# EAGLE design Final_eagle (EAGLE 9.2.0)
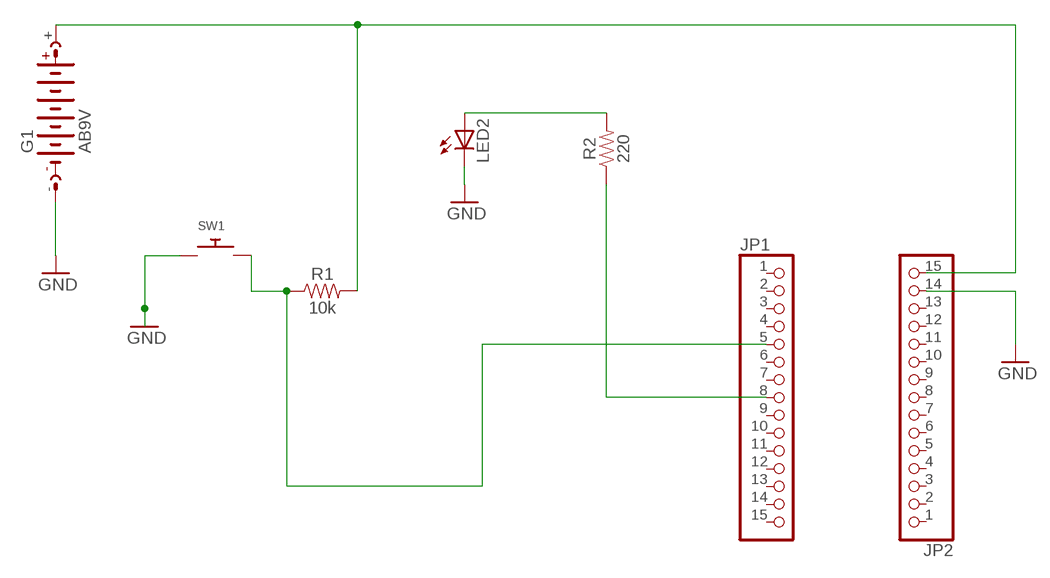
[diagram p0: schematic, sheet 1]

## Parts
G1  AB9V  [AB9V]
JP1  PINHD-1X15  [1X15]
JP2  PINHD-1X15  [1X15]
LED2  LED5MM  [LED5MM]
R1  10k  10KOHM-VERT-1/4W-5%  [AXIAL-0.1]
R2  220  100OHM-0603-1/4W-5%  [0603]
SW1  SWITCH_PUSHBUTTONEVQ-PE  [TACT_PANA-EVQ]

## Nets
GND: G1.- JP2.14 LED2.K(C) SW1.P$1
N$1: G1.+ JP2.15 R1.P$2
N$3: JP1.5 R1.P$1 SW1.P$2
N$4: JP1.8 R2.1
N$5: LED2.A R2.2
Unconnected: JP1.1 JP1.2 JP1.3 JP1.4 JP1.6 JP1.7 JP1.9 JP1.10 JP1.11 JP1.12 JP1.13 JP1.14 JP1.15 JP2.1 JP2.2 JP2.3 JP2.4 JP2.5 JP2.6 JP2.7 JP2.8 JP2.9 JP2.10 JP2.11 JP2.12 JP2.13

## Library data of the parts
G1 = battery:AB9V: 9-V BATTERY CLIP
JP1 JP2 = adafruit:PINHD-1X15: PIN HEADER
LED2 = adafruit:LED: LED OSRAM: - CHIPLED LG R971, LG N971, LY N971, LG Q971, LY Q971, LO R971, LY R971 LH N974, LH R974 LS Q976, LO Q976, LY Q976 LO Q996 - Hyper CHIPLED LW Q18S LB Q993, LB Q99A, LB R99A - SideLED LS A670, LO A670, LY A670, LG A670, LP A670 LB A673, LV A673, LT A673, LW A673 LH A674 LY A675 LS A676, LA A676, LO A676, LY A676, LW A676 LS A679, LY A679, LG A679 - Hyper Micro SIDELED® LS Y876, LA Y876, LO Y876, LY Y876 LT Y87S - SmartLED LW L88C, LW L88S LB L89C, LB L89S, LG L890 LS L89K, LO L89K, LY L89K LS L896, LA L896, LO L896, LY L896 - TOPLED LS T670, LO T670, LY T670, LG T670, LP T670 LSG T670, LSP T670, LSY T670, LOP T670, LYG T670 LG T671, LOG T671, LSG T671 LB T673, LV T673, LT T673, LW T673 LH T674 LS T676, LA T676, LO T676, LY T676, LB T676, LH T676, LSB T676, LW T676 LB T67C, LV T67C, LT T67C, LS T67K, LO T67K, LY T67K, LW E67C LS E67B, LA E67B, LO E67B, LY E67B, LB E67C, LV E67C, LT E67C LW T67C LS T679, LY T679, LG T679 LS T770, LO T770, LY T770, LG T770, LP T770 LB T773, LV T773, LT T773, LW T773 LH T774 LS E675, LA E675, LY E675, LS T675 LS T776, LA T776, LO T776, LY T776, LB T776 LHGB T686 LT T68C, LB T68C - Hyper Mini TOPLED® LB M676 - Mini TOPLED Santana® LG M470 LS M47K, LO M47K, LY M47K Source: http://www.osram.convergy.de/
R1 = SparkFun-Resistors:10KOHM: 10kΩ resistor A resistor is a passive two-terminal electrical component that implements electrical resistance as a circuit element. Resistors act to reduce current flow, and, at the same time, act to lower voltage levels within circuits. - Wikipedia; PROD_ID: RES-09435
R2 = SparkFun-Resistors:100OHM: 100Ω resistor A resistor is a passive two-terminal electrical component that implements electrical resistance as a circuit element. Resistors act to reduce current flow, and, at the same time, act to lower voltage levels within circuits. - Wikipedia; PROD_ID: RES-12438; VALUE: 100
SW1 = adafruit:SWITCH_PUSHBUTTON: Buttons SOFTTOUCHSMD_SJ - Soft touch temporary push button (Super Junk Akihabara) Compatible with SKPMANE010 [Mouser: 688-SKPMAN] C&K_KSS = Digikey: KSS221GLFS

## Board
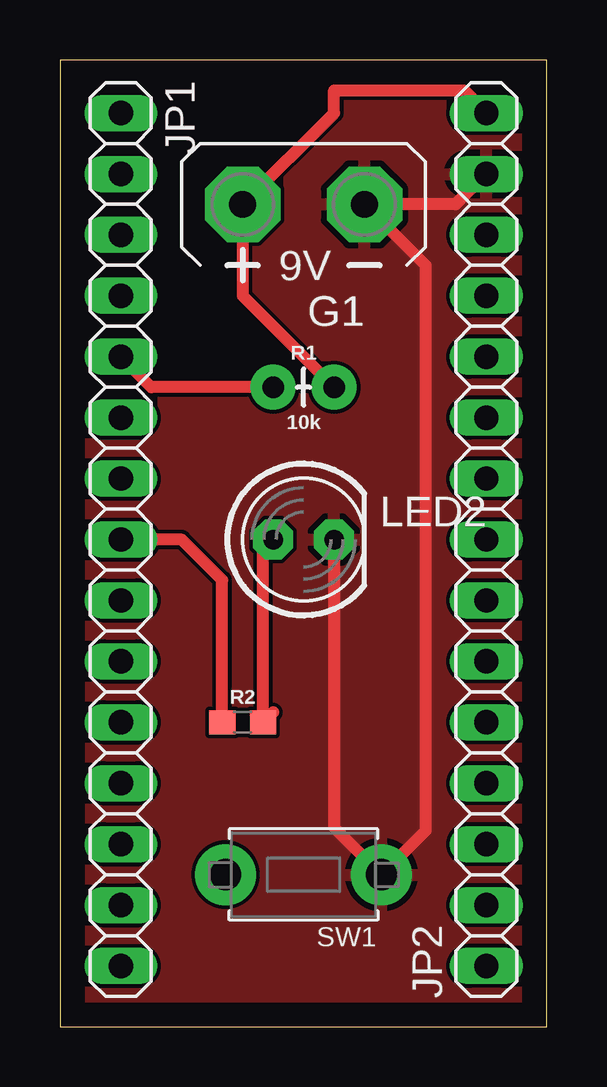
[diagram p1: board, top side]
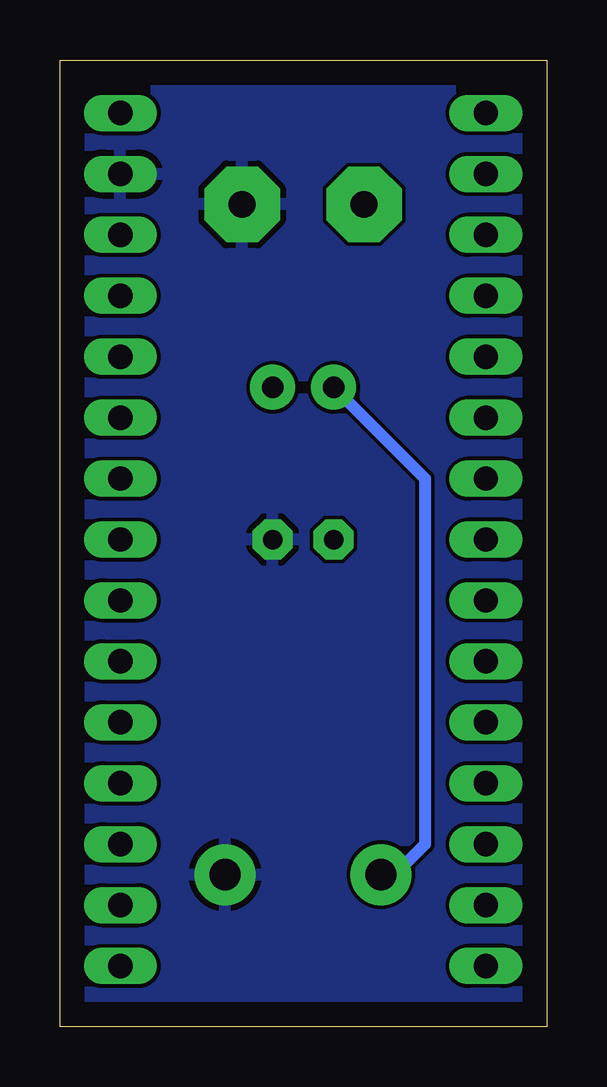
[diagram p2: board, bottom side, seen from below]

Size 20.3 x 40.31 mm. Coordinates in mm from the lower left corner, seen from the top.
Outline: 0,0 20.3,0 20.3,40.31 0,40.31 0,0
Copper layers (1*16): Top 0.035mm / dielectric 1.5mm / Bottom 0.035mm
Design rules "default": minimum track width 6mil, minimum drill 0.35mm, track to track 6mil, track to pad 6mil, pad to pad 6mil, via to via 6mil, smd to smd 6mil, copper to edge 40mil, drill to drill 6mil, minimum pad ring 10mil, minimum via ring 8mil, stop-mask expansion 4mil, vias tented up to drill 0mil, thermal gap 10mil

### Footprints (pad centres in the part's own frame; a part is rotated, then mirrored left to right if it is on the bottom)
AB9V = drill 1.118 pad 3.15 octagon: + 0,2.54; - 0,-2.54
1X15 = drill 1.016 long: 1 -17.78,0; 2 -15.24,0; 3 -12.7,0; 4 -10.16,0; 5 -7.62,0; 6 -5.08,0; 7 -2.54,0; 8 0,0; 9 2.54,0; 10 5.08,0; 11 7.62,0; 12 10.16,0; 13 12.7,0; 14 15.24,0; 15 17.78,0
LED5MM = drill 0.813 pad 1.676 octagon: A -1.27,0; K 1.27,0
AXIAL-0.1 = drill 0.9 pad 1.88: P$1 -1.27,0; P$2 1.27,0
0603 = smd 1.1 x 1: 1 -0.85,0; 2 0.85,0
TACT_PANA-EVQ = drill 1.3 pad 2.54: P$1 -3.25,0; P$2 3.25,0

### Placement (x,y rotation side)
G1  10.16,34.29 90 top
JP1  2.54,20.32 270 top
JP2  17.78,20.32 90 top
LED2  10.16,20.32 0 top
R1  10.16,26.67 0 top
R2  7.62,12.7 0 top
SW1  10.16,6.35 180 top

### Tracks (layer width: path | path; a pad name or v marks a point on that pad's centre or on a via)
GND
  Top 0.508: JP2.14 16.51,34.29 G1.- | G1.- 13.97,33.02 | G1.- 15.24,31.75 15.24,8.18 SW1.P$1 11.43,8.33 LED2.K
  pour Top: 0,40.64 20.32,40.64 20.32,1.27 19.05,0 1.27,0 0,1.27
  pour Bottom: 0,40.64 0,0 20.32,0 20.32,40.64
N$1
  Top 0.508: R1.P$2 7.62,30.48 G1.+ 11.43,38.1 11.43,39.04 16.84,39.04 JP2.15
N$3
  Top 0.508: R1.P$1 3.81,26.67 JP1.5 | SW1.P$2 6.35,6.91
  Bottom 0.508: 3.81,27.94 JP1.5 | R1.P$1 5.08,22.86 5.08,7.62 6.35,6.35 SW1.P$2
N$4
  Top 0.508: R2.1 6.77,18.63 5.08,20.32 JP1.8
N$5
  Top 0.508: 8.89,13.12 R2.2 8.47,19.9 LED2.A